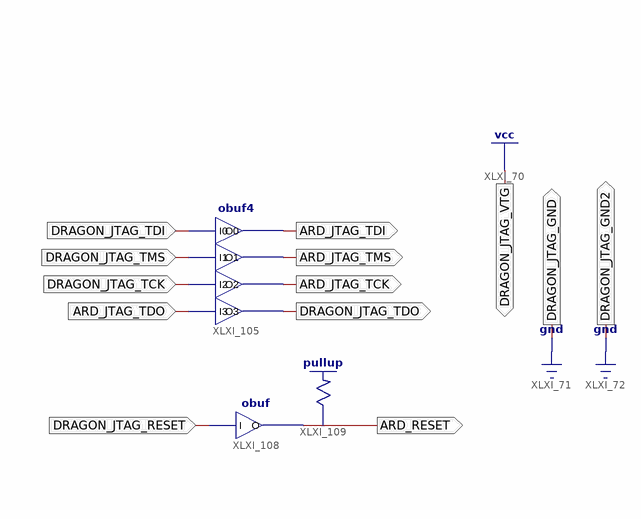
[diagram p0: schematic sheet 1]
// Xilinx ISE schematic Papilio_DUO_LX9.sch (spartan6) as structural Verilog: 3 symbols, 13 ports
module Papilio_DUO_LX9 (
  input  DRAGON_JTAG_TDI,
  input  DRAGON_JTAG_TMS,
  input  DRAGON_JTAG_TCK,
  input  ARD_JTAG_TDO,
  input  DRAGON_JTAG_RESET,
  output ARD_JTAG_TDI,
  output ARD_JTAG_TMS,
  output ARD_JTAG_TCK,
  output DRAGON_JTAG_TDO,
  output DRAGON_JTAG_GND,
  output DRAGON_JTAG_GND2,
  output ARD_RESET,
  output DRAGON_JTAG_VTG
);

  obuf4 XLXI_105 (
    .I0(DRAGON_JTAG_TDI), .I1(DRAGON_JTAG_TMS), .I2(DRAGON_JTAG_TCK), .I3(ARD_JTAG_TDO), .O0(ARD_JTAG_TDI),
    .O1(ARD_JTAG_TMS), .O2(ARD_JTAG_TCK), .O3(DRAGON_JTAG_TDO));
  obuf XLXI_108 (.I(DRAGON_JTAG_RESET), .O(ARD_RESET));
  \pullup  XLXI_109 (.O(ARD_RESET));

  assign DRAGON_JTAG_GND = 1'b0;
  assign DRAGON_JTAG_GND2 = 1'b0;
  assign DRAGON_JTAG_VTG = 1'b1;
endmodule
